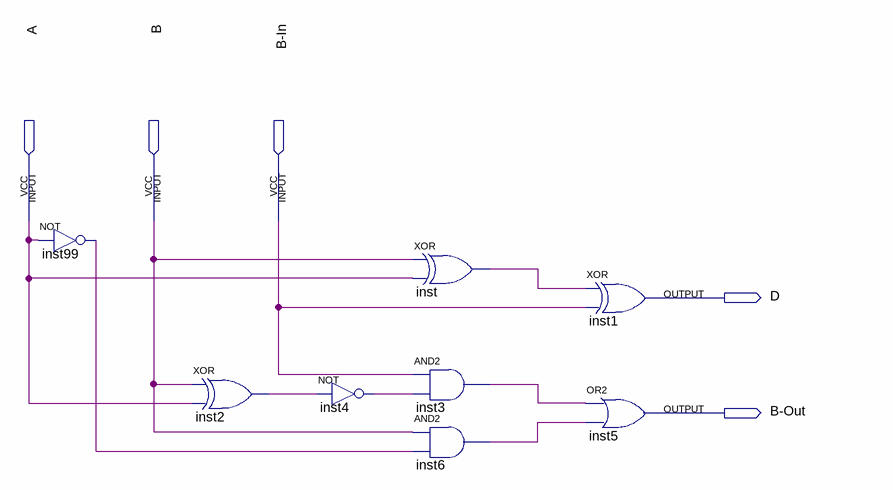
[diagram p0: schematic sheet]
// Quartus schematic FullSubtractor1.bdf as structural Verilog: 8 symbols, 5 pins
module FullSubtractor1 (
  input  A,
  input  B,
  input  \B-In ,
  output D,
  output \B-Out 
);

  wire inst2_out, inst3_out, inst4_out, inst6_out, inst99_out, inst_out;

  not inst99 (inst99_out, A);
  xor inst2 (inst2_out, B, A);
  not inst4 (inst4_out, inst2_out);
  xor inst (inst_out, B, A);
  and inst3 (inst3_out, \B-In , inst4_out);
  and inst6 (inst6_out, B, inst99_out);
  xor inst1 (D, inst_out, \B-In );
  or inst5 (\B-Out , inst3_out, inst6_out);
endmodule
